# Altium schematic sheet esc_inputs.SchDoc: Fault-Tolerant Quadcopter
size A; DrawnBy: Vaughn Kottler; Engineer: Vaughn Kottler; Revision: A
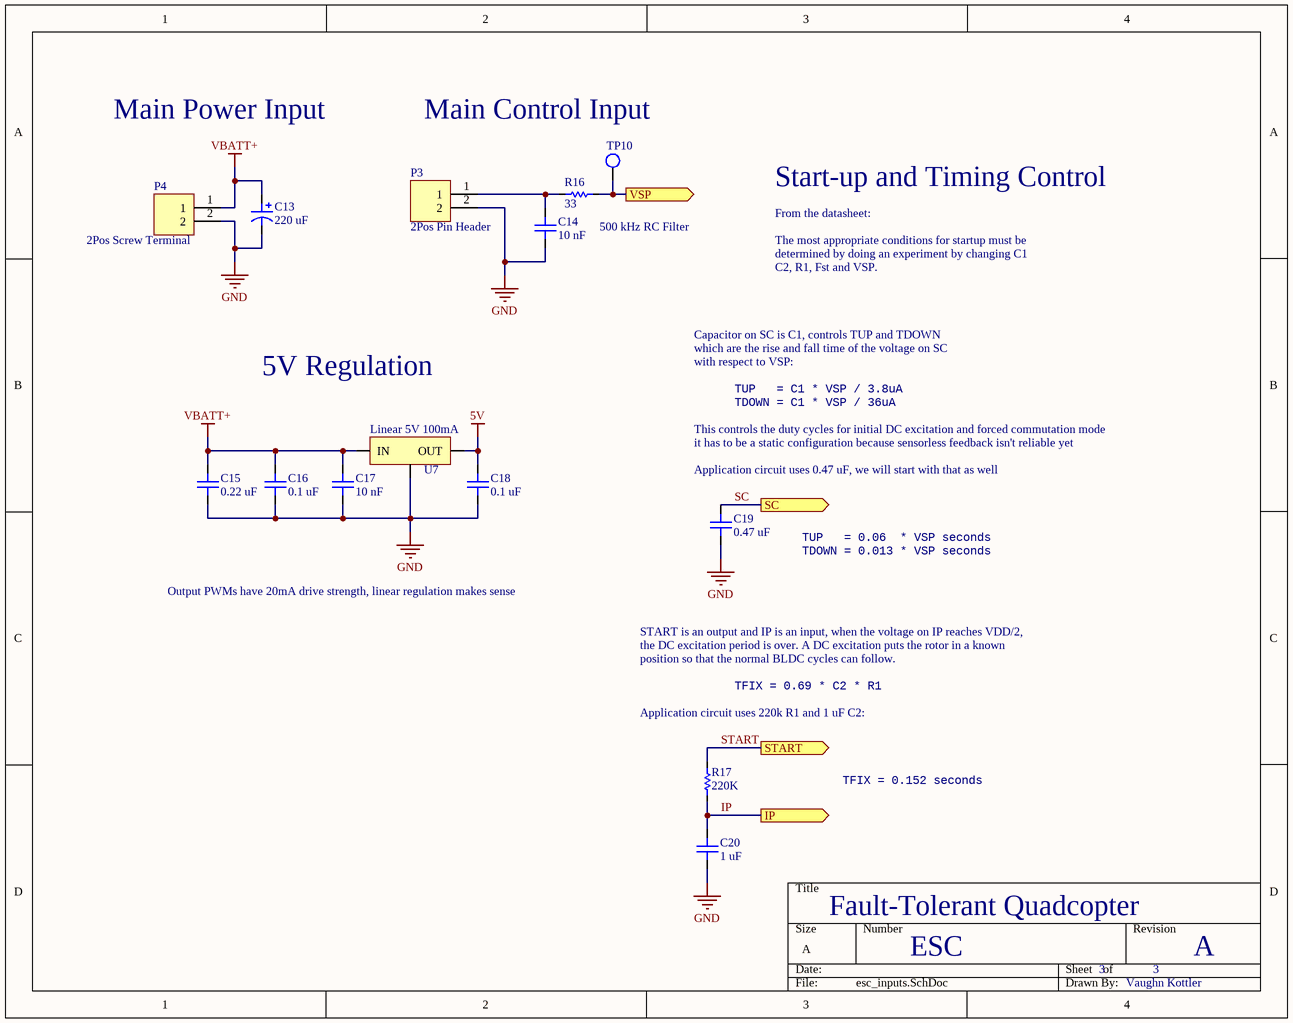
[diagram p0: esc_inputs.SchDoc]

## Parts
C13  220 uF  [CAP-CAN-8.3x8.3]
C14  10 nF  [CAP-CER-0805-SHORT]
C15  0.22 uF  [CAP-CER-0805-SHORT]
C16  0.1 uF  [CAP-CER-0805-SHORT]
C17  10 nF  [CAP-CER-0805-SHORT]
C18  0.1 uF  [CAP-CER-0805-SHORT]
C19  0.47 uF  [CAP-CER-0805-TALL]
C20  1 uF  [CAP-CER-0805-TALL]
P3  2Pos Pin Header  [2Pos Pin Header F RA R]
P4  2Pos Screw Terminal  [2Pos Screw Terminal]
R16  33  [RES-0805]
R17  220K  [RES-0805]
TP10  Test Point  [0603 Test Point]  (value not drawn)
U7  Linear 5V 100mA  [SOT-89]

## Ports
IP (out), SC (out), START (out), VSP (out)

## Nets
5V: C18.2 U7.1(OUT)
GND: C13.2 C14.1 C15.1 C16.1 C17.1 C18.1 C19.1 C20.1 P3.2 P4.2 U7.2(GND)
VBATT+: C13.1 C15.2 C16.2 C17.2 P4.1 U7.3(IN)
IP: C20.2 R17.1 ; port IP
SC: C19.2 ; port SC
START: R17.2 ; port START
VSP: R16.2 TP10.1 ; port VSP
NetC14_2: C14.2 P3.1 R16.1

## Notes on the sheet
- Main Power Input
- (near TP10) Main Control Input
- (near R16) 500 kHz RC Filter
- From the datasheet:
- Start-up and Timing Control
- The most appropriate conditions for startup must be
- determined by doing an experiment by changing C1
- C2, R1, Fst and VSP.
- Capacitor on SC is C1, controls TUP and TDOWN
- which are the rise and fall time of the voltage on SC
- with respect to VSP:
- 5V Regulation
- This controls the duty cycles for initial DC excitation and forced commutation mode
- TUP   = C1 * VSP / 3.8uA
- TDOWN = C1 * VSP / 36uA
- (near C19) Application circuit uses 0.47 uF, we will start with that as well
- it has to be a static configuration because sensorless feedback isn't reliable yet
- TUP   = 0.06  * VSP seconds
- TDOWN = 0.013 * VSP seconds
- Output PWMs have 20mA drive strength, linear regulation makes sense
- START is an output and IP is an input, when the voltage on IP reaches VDD/2,
- the DC excitation period is over. A DC excitation puts the rotor in a known
- position so that the normal BLDC cycles can follow.
- TFIX = 0.69 * C2 * R1
- (near R17) Application circuit uses 220k R1 and 1 uF C2:
- TFIX = 0.152 seconds
- ESC
- 3

## Library data of the parts
C13 = CAP-CAN-220uF-35V: ±20%, 8.3mm x 8.3mm; Supplier 1: Digi-Key; Supplier Part Number 1: PCE3955DKR-ND
C14 = CAP-CER-10nF-50V: 10%, 0805; ComponentLink1Description: Capacitor Book (Amazon); ComponentLink1URL: https://www.amazon.com/gp/product/B0728HBDRW/
C15 = CAP-CER-0.22uF-50V: 10%, 0805; ComponentLink1Description: Capacitor Book (Amazon); ComponentLink1URL: https://www.amazon.com/gp/product/B0728HBDRW/
C16 C18 = CAP-CER-0.1uF-25V: 10%, 0805; ComponentLink1Description: Capacitor Book (Amazon); ComponentLink1URL: https://www.amazon.com/gp/product/B0728HBDRW/
C17 = CAP-CER-10nF-50V: ±10%, 0805; ComponentLink1Description: Capacitor Book (Amazon); ComponentLink1URL: https://www.amazon.com/gp/product/B0728HBDRW/
C19 = CAP-CER-0.47uF-50V: ±10%, 0805; ComponentLink1Description: Capacitor Book (Amazon); ComponentLink1URL: https://www.amazon.com/gp/product/B0728HBDRW/
C20 = CAP-CER-1uF-10V: ±10%, 0805; ComponentLink1Description: Capacitor Book (Amazon); ComponentLink1URL: https://www.amazon.com/gp/product/B0728HBDRW/
P3 = 2Pos Pin Header: 0.1" Pitch 1x2
P4 = 2Pos Screw Terminal: 0.2" Pitch 1x2
R16 = RES-33-1/8W: 0805; ComponentLink1Description: Resistor Book (Amazon); ComponentLink1URL: https://www.amazon.com/gp/product/B071J21FYF/
R17 = RES-220K-1/8W: 0805; ComponentLink1Description: Resistor Book (Amazon); ComponentLink1URL: https://www.amazon.com/gp/product/B071J21FYF/
TP10 = Test Point: 0603; Supplier 1: Digi-Key; Supplier Part Number 1: A106145DKR-ND
U7 = L78L05ACUTR: Linear Regulator, 5V, 100mA; Supplier 1: Digi-Key; ComponentLink1Description: Datasheet; ComponentLink1URL: https://www.st.com/content/ccc/resource/technical/document/datasheet/15/55/e5/aa/23/5b/43/fd/CD00000446.pdf/files/CD00000446.pdf/jcr:content/translations/en.CD00000446.pdf; Supplier Part Number 1: 497-1183-6-ND